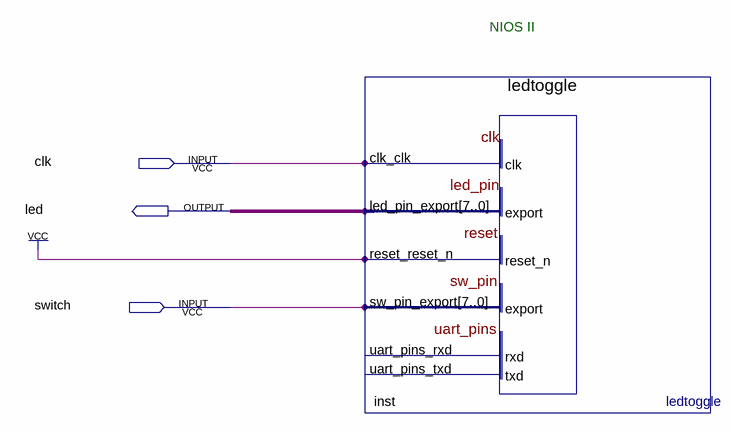
[diagram p0: schematic sheet]
// Quartus schematic LedToggle.bdf as structural Verilog: 1 symbols, 3 pins
module LedToggle (
  input  clk,
  input  switch,
  output led
);

  wire [7:0] inst_led_pin_export;

  ledtoggle inst (
    .clk_clk(clk), .reset_reset_n(1'b1), .sw_pin_export({8{switch}}), .led_pin_export(inst_led_pin_export));  // open: uart_pins_rxd, uart_pins_txd

  // Notes on the sheet:
  //   NIOS II
endmodule
